# Altium schematic sheet RelayDriver.SchDoc
size A4; CompanyName: Hydriven; Organization: Hydriven; Revision: V1.1; SheetNumber: 8; SheetTotal: 10; Team: 2025; Subsystem: Embedded Systems
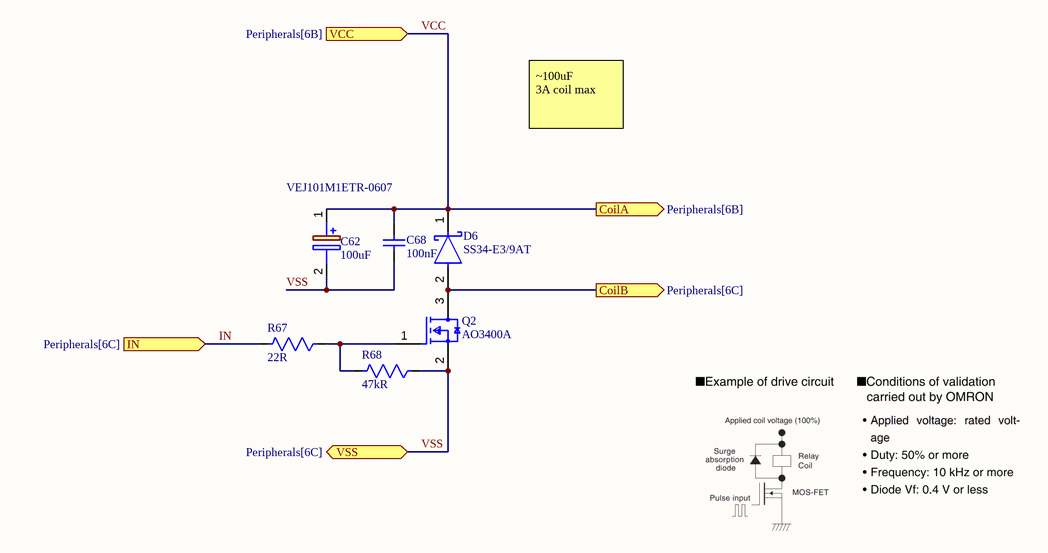
[diagram p0: RelayDriver.SchDoc]

## Parts
C62  VEJ101M1ETR-0607  value 100uF  [CAPAE660X800N]
C68  value 100nF  [WCAP-CSGP_0402_L1W0.5H0.5]  (hidden comment: CAP 0402 100nF X7R)
D6  SS34-E3/9AT  [FP-SMC-MFG]
Q2  AO3400A  [FP-SOT23-MFG]
R67  value 22R  [RES_SM0603_YAGEORC_N]  (hidden comment: RES 0603 22R 1%)
R68  value 47kR  [RES_SM0603_YAGEORC_N]  (hidden comment: RES 0603 47kR 1%)

## Ports
CoilA (out, see Peripherals[6B]), CoilB (out, see Peripherals[6C]), IN (in, see Peripherals[6C]), VCC (in, see Peripherals[6B]), VSS (bidir, see Peripherals[6C])

## Nets
CoilB: D6.2(A) Q2.3(D) ; port CoilB
IN: R67.2 ; port IN
VCC: C62.1(+) C68.2 D6.1(C) ; port VCC, port CoilA
VSS: C62.2(-) C68.1 Q2.2(S) R68.1 ; port VSS
NetQ2_1: Q2.1(G) R67.1 R68.2

## Notes on the sheet
- ~100uF
  3A coil max
- Team
- Authors
- Revision
- Title
- Project
- Subsystem
- File
- Sheet
- //

## Library data of the parts
C62 = VEJ101M1ETR-0607: Capacitor Polarised; Manufacturer_Name: Lelon; Datasheet Link: https://www.mouser.de/datasheet/2/231/161587198639-2307150.pdf; Height: 8mm; Manufacturer_Part_Number: VEJ101M1ETR-0607; JLCPCB Part #: C176664
C68 = CMP-001-01308-5: GTT Standard 0402 non-polarized capacitor; Pins: 2; Case/Package: 0402; Category: Multilayer Ceramic Chip Capacitors; Ceramic Type: X7R; JLCPCB Part #: C1525
D6 = CMP-02539-000066-1: DIODE SCHOTTKY 40V 3A DO214AB; Peak Non-Repetitive Surge Current: 100A; Forward Voltage: 500mV; Element Configuration: Single; Max Reverse Current: 500uA; Case/Package: SMC; Radiation Hardening: No; Series: -; Max Surge Current: 100A; RoHS Compliant: Yes; Min Operating Temperature: -55°C; Average Rectified Current: 3A; Max Reverse Leakage Current: 500uA; Package Quantity: 3500; Max Reverse Voltage (DC): 40V; Forward Current: 3A; Packaging: Tape and Reel; Max Operating Temperature: 125°C; Max Repetitive Reverse Voltage (Vrrm): 40V; Number of Pins: 2; Mount: Surface Mount; JLCPCB Part #: C3008890
Q2 = CMP-83955-000006-1: MOSFET N-CH 30V 5.7A SOT23; Input Capacitance: 630pF; Number of Elements: 1; Rds On Max: 26.5mR; Max Power Dissipation: 1.4W; Gate to Source Voltage (Vgs): 12V; Min Operating Temperature: -55°C; Lead Free: Lead Free; Number of Pins: 3; Drain to Source Voltage (Vdss): 30V; Case/Package: SOT-23; Mount: Surface Mount; Continuous Drain Current (ID): 5.7A; Radiation Hardening: No; Packaging: Tape and Reel; Max Operating Temperature: 150°C; Power Dissipation: 1.4W
R67 R68 = CMP-009-00206-3: GTT Standard 0603 Resistor; Voltage Rating: 50V; Power: 62.5mW; Case/Package: 0603; Tolerance: 1%; Mounting Technology: SMD
  R67: JLCPCB Part #: C23345
  R68: JLCPCB Part #: C25819